# EasyEDA Pro project ProPrj_DiscoTech 6 Current_2026-05-06.epro, schematic Master

## Sheets
1 Volume/EQ: Board Name: Master; Create Date: 2025-11-04; Page Name: Volume/EQ; Project Name: DiscoTech 6 Current; Schematic Name: Master; Update Date: 2026-04-23; Company: EasyEDA.com; Page Size: A4; Version: V1.0
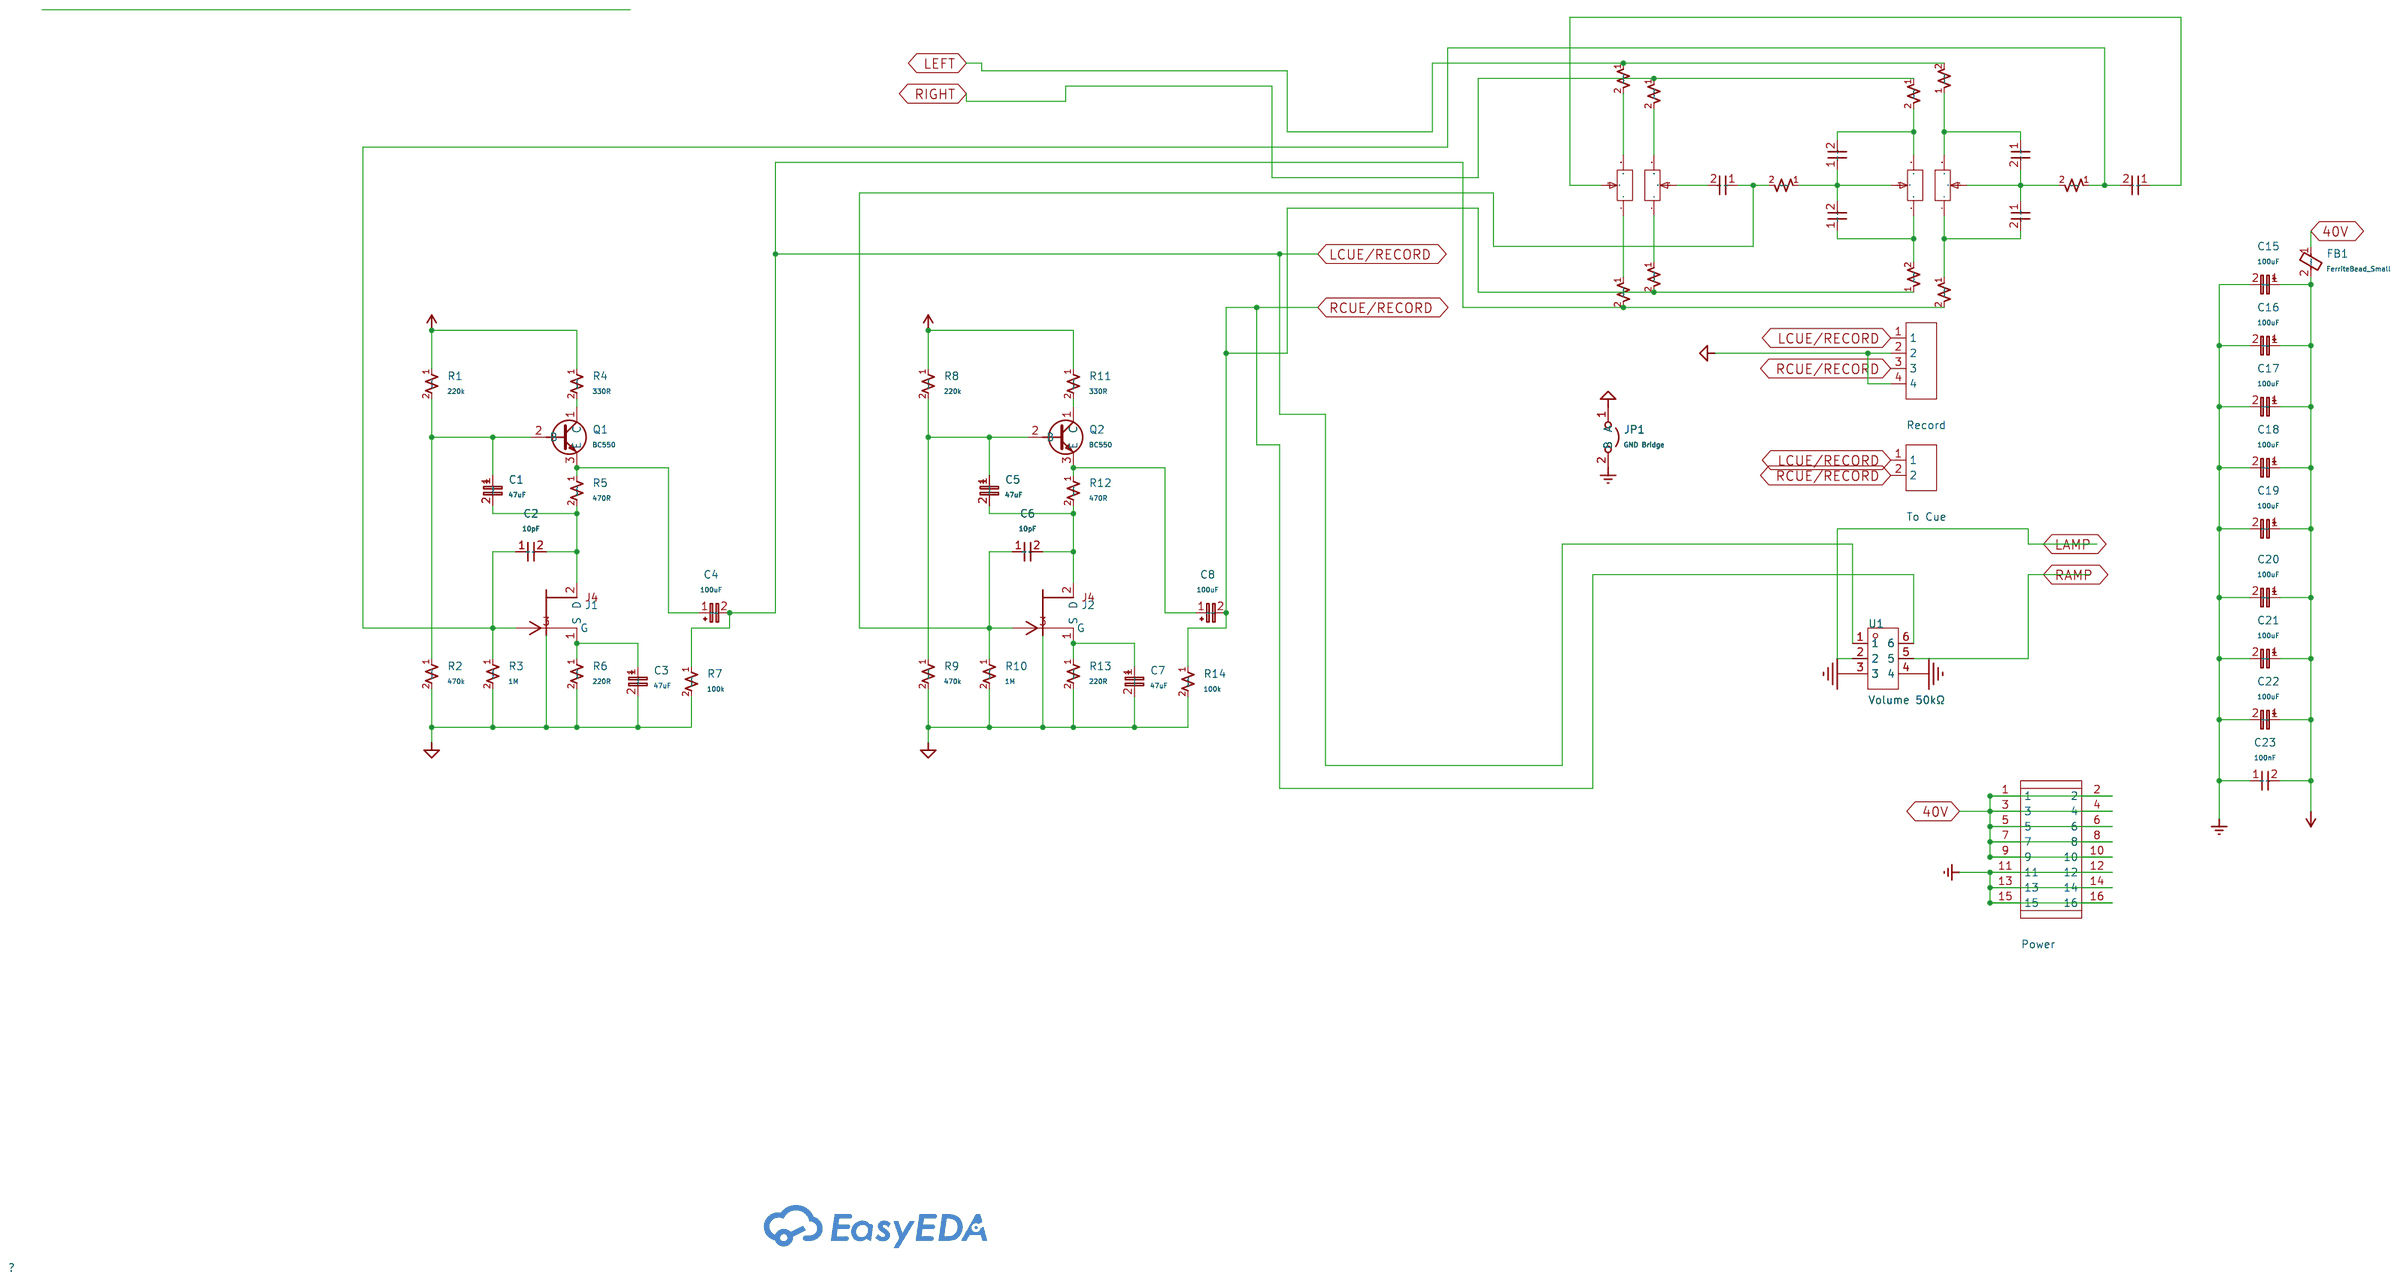
[diagram p9: Volume/EQ]
2 Summing: Page Name: Summing; Update Date: 2025-11-04
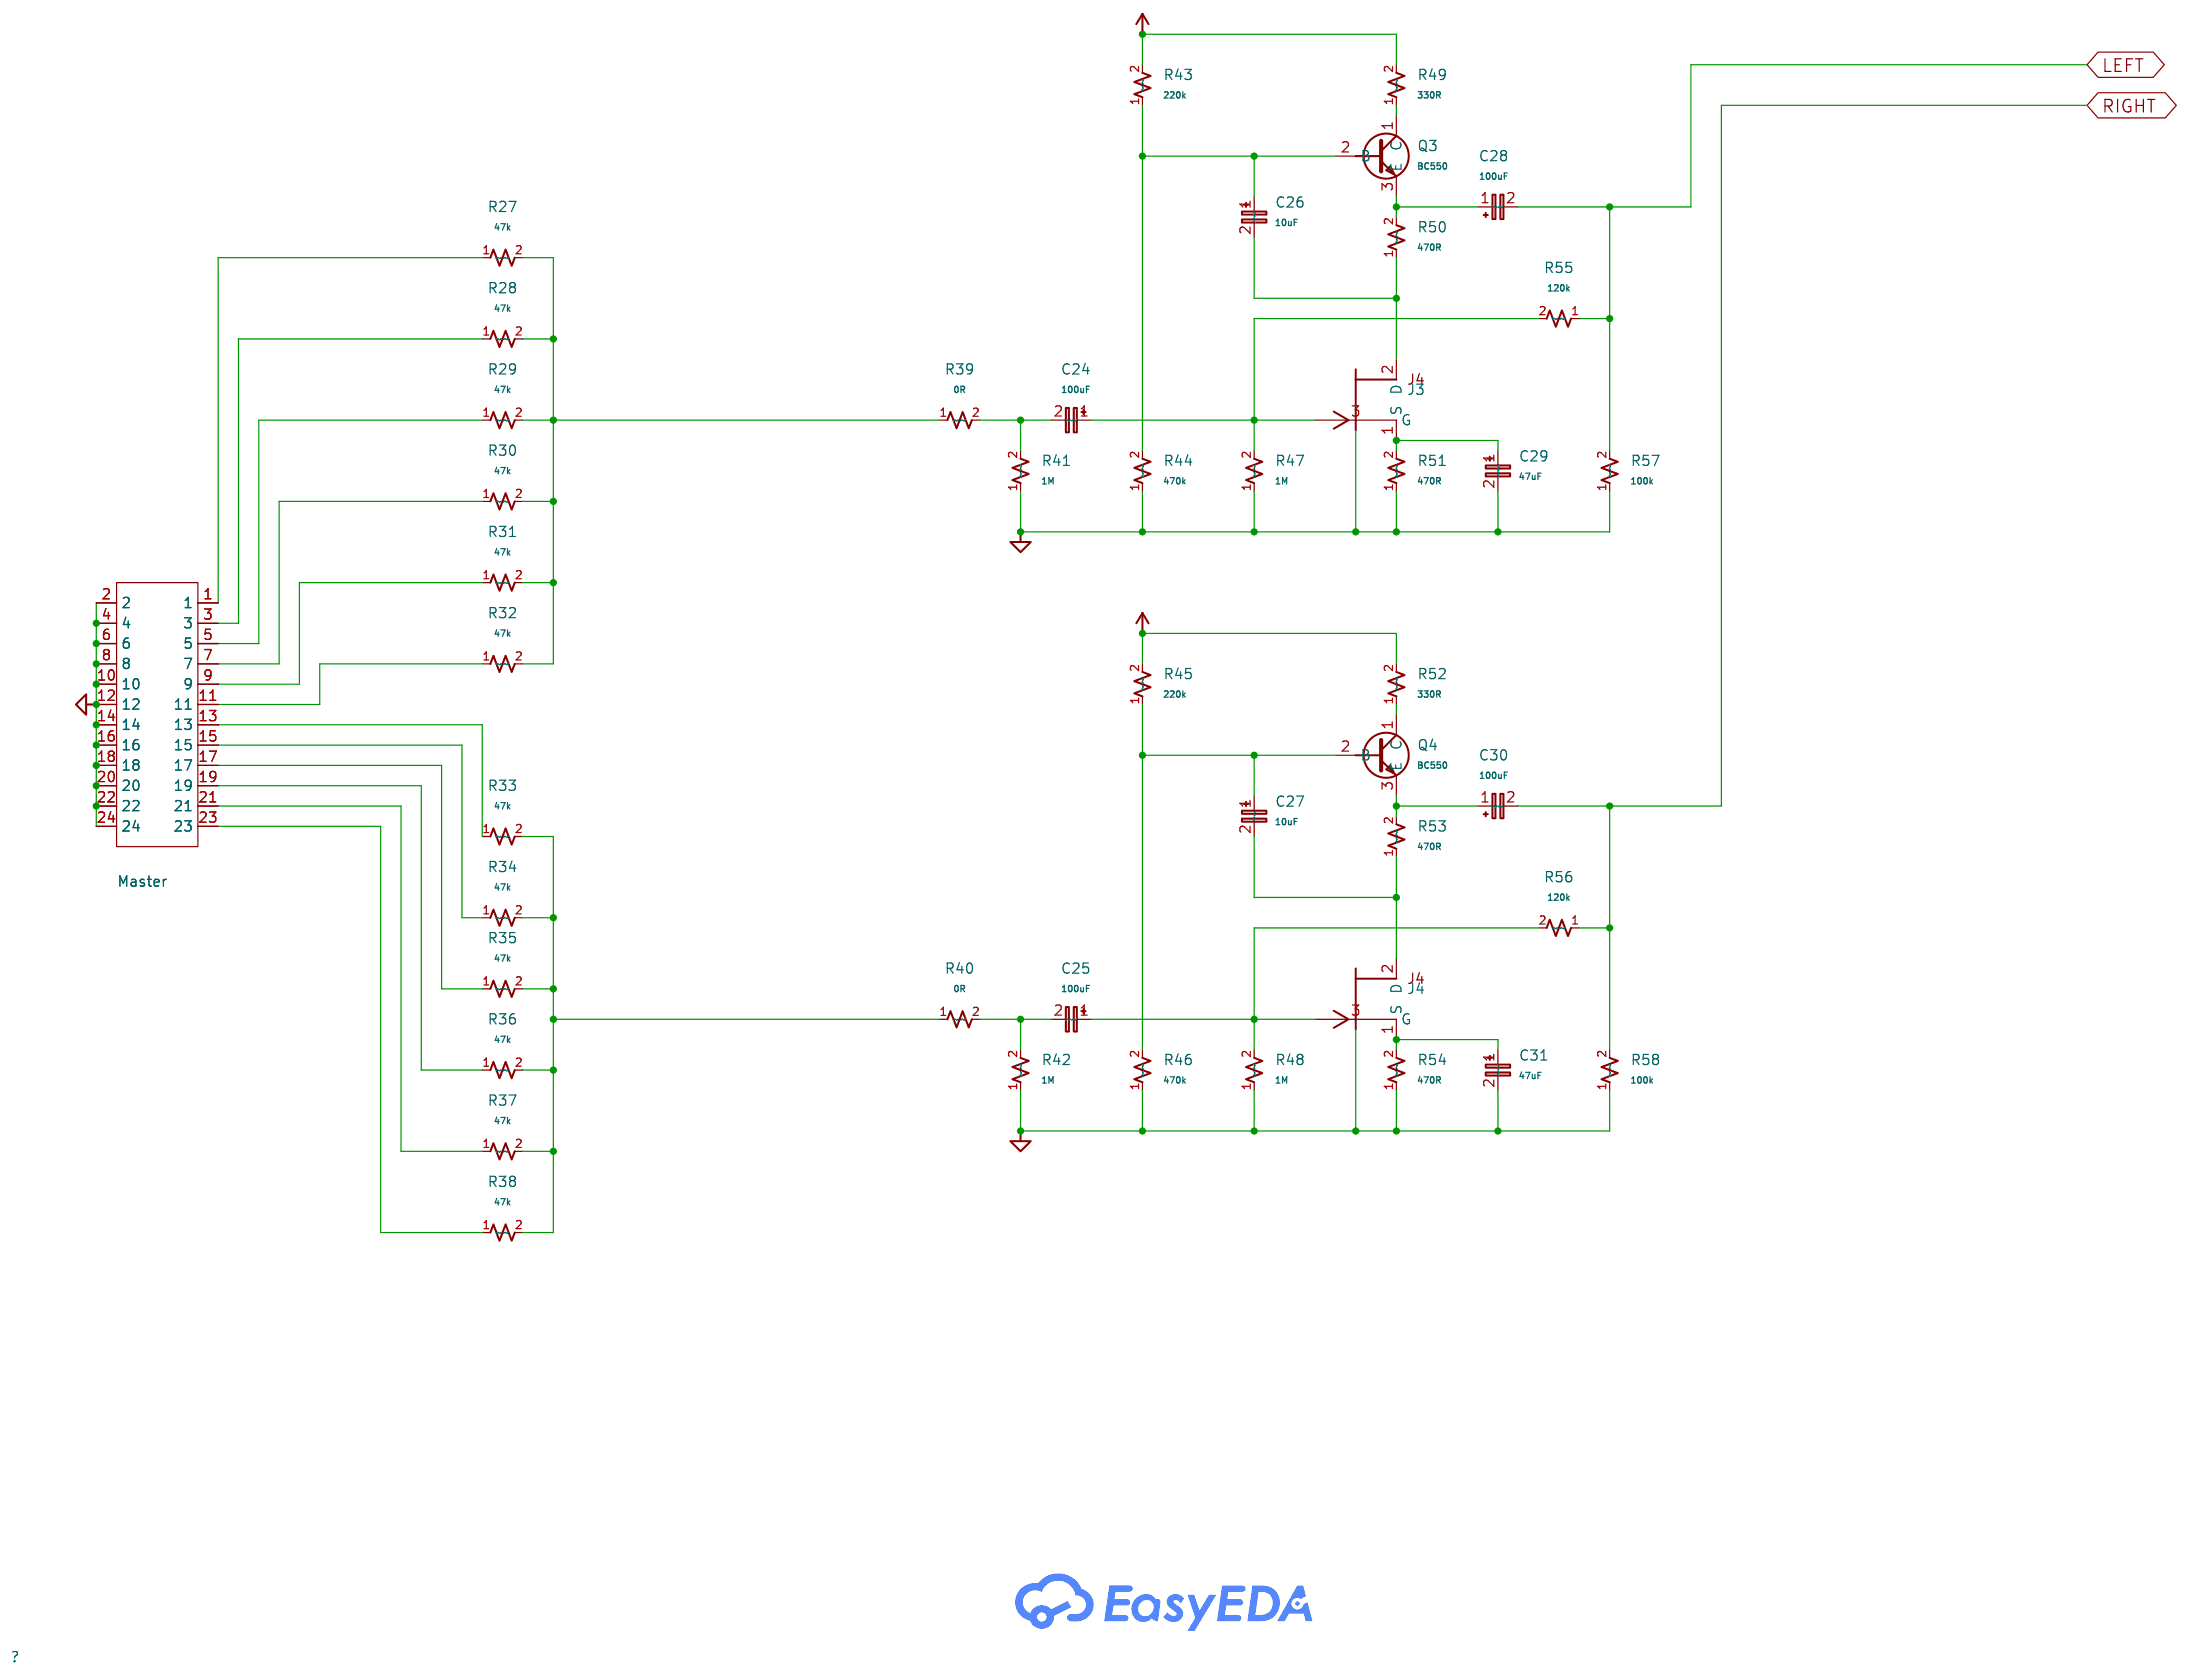
[diagram p10: Summing]
3 Amp: Create Date: 2025-11-05; Page Name: Amp; Update Date: 2026-04-27
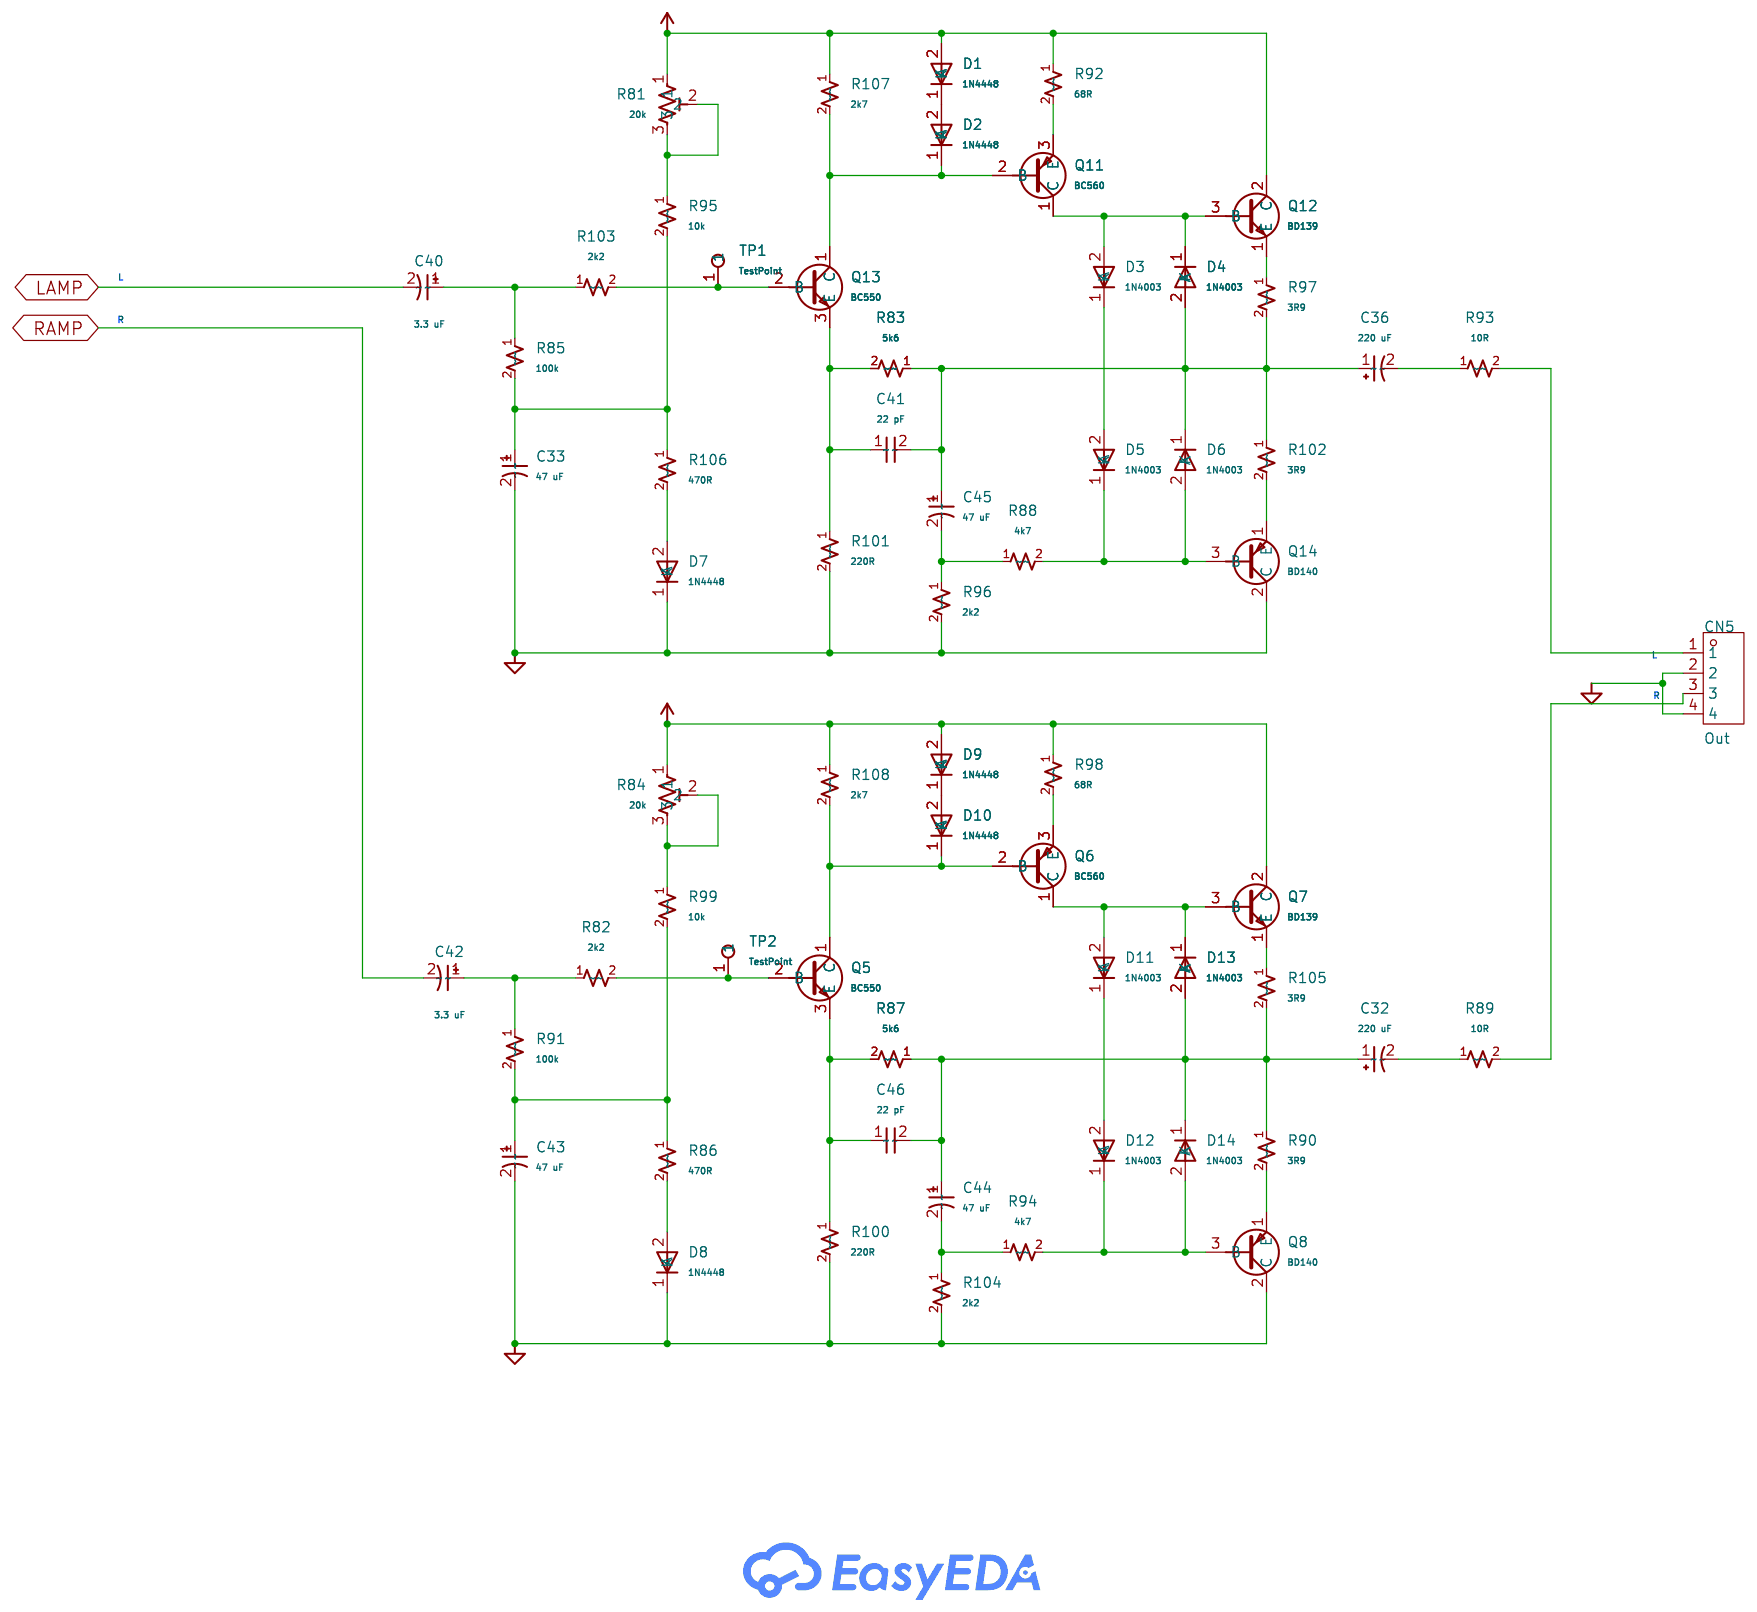
[diagram p11: Amp]

## Parts
sheet Amp
C32  220 uF  [Capacitor_THT:CP_Radial_D10.0mm_P5.00mm]
C33  47 uF  [Capacitor_THT:CP_Radial_D6.3mm_P2.50mm]
C36  220 uF  [Capacitor_THT:CP_Radial_D10.0mm_P5.00mm]
C40  3.3 uF  [Capacitor_THT:CP_Radial_Tantal_D5.0mm_P5.00mm]
C41  22 pF  [Capacitor_THT:C_Disc_D3.8mm_W2.6mm_P2.50mm]
C42  3.3 uF  [Capacitor_THT:CP_Radial_Tantal_D5.0mm_P5.00mm]
C43  47 uF  [Capacitor_THT:CP_Radial_D6.3mm_P2.50mm]
C44  47 uF  [Capacitor_THT:CP_Radial_D6.3mm_P2.50mm]
C45  47 uF  [Capacitor_THT:CP_Radial_D6.3mm_P2.50mm]
C46  22 pF  [Capacitor_THT:C_Disc_D3.8mm_W2.6mm_P2.50mm]
CN5  Out  [CONN-TH_4P-P2.50-XH2.54-4P]
D1  1N4448  [Diode_THT:D_DO-35_SOD27_P7.62mm_Horizontal]
D2  1N4448  [Diode_THT:D_DO-35_SOD27_P7.62mm_Horizontal]
D3  1N4003  [Diode_THT:D_DO-41_SOD81_P10.16mm_Horizontal]
D4  1N4003  [Diode_THT:D_DO-41_SOD81_P10.16mm_Horizontal]
D5  1N4003  [Diode_THT:D_DO-41_SOD81_P10.16mm_Horizontal]
D6  1N4003  [Diode_THT:D_DO-41_SOD81_P10.16mm_Horizontal]
D7  1N4448  [Diode_THT:D_DO-35_SOD27_P7.62mm_Horizontal]
D8  1N4448  [Diode_THT:D_DO-35_SOD27_P7.62mm_Horizontal]
D9  1N4448  [Diode_THT:D_DO-35_SOD27_P7.62mm_Horizontal]
D10  1N4448  [Diode_THT:D_DO-35_SOD27_P7.62mm_Horizontal]
D11  1N4003  [Diode_THT:D_DO-41_SOD81_P10.16mm_Horizontal]
D12  1N4003  [Diode_THT:D_DO-41_SOD81_P10.16mm_Horizontal]
D13  1N4003  [Diode_THT:D_DO-41_SOD81_P10.16mm_Horizontal]
D14  1N4003  [Diode_THT:D_DO-41_SOD81_P10.16mm_Horizontal]
Q5  BC550  [TO-92-3_L4.8-W3.7-P2.60-L_LP0003A]
Q6  BC560  [TO-92-3_L4.8-W3.7-P2.60-L_LP0003A]
Q7  BD139  [Package_TO_SOT_THT:TO-126-3_Vertical]
Q8  BD140  [Package_TO_SOT_THT:TO-126-3_Vertical]
Q11  BC560  [TO-92-3_L4.8-W3.7-P2.60-L_LP0003A]
Q12  BD139  [Package_TO_SOT_THT:TO-126-3_Vertical]
Q13  BC550  [TO-92-3_L4.8-W3.7-P2.60-L_LP0003A]
Q14  BD140  [Package_TO_SOT_THT:TO-126-3_Vertical]
R81  20k  [Potentiometer_THT:Potentiometer_Bourns_3296W_Vertical]
R82  2k2  [Resistor_THT:R_Axial_DIN0207_L6.3mm_D2.5mm_P7.62mm_Horizontal]
R83  5k6  [Resistor_THT:R_Axial_DIN0207_L6.3mm_D2.5mm_P7.62mm_Horizontal]
R84  20k  [Potentiometer_THT:Potentiometer_Bourns_3296W_Vertical]
R85  100k  [Resistor_THT:R_Axial_DIN0207_L6.3mm_D2.5mm_P7.62mm_Horizontal]
R86  470R  [Resistor_THT:R_Axial_DIN0207_L6.3mm_D2.5mm_P7.62mm_Horizontal]
R87  5k6  [Resistor_THT:R_Axial_DIN0207_L6.3mm_D2.5mm_P7.62mm_Horizontal]
R88  4k7  [Resistor_THT:R_Axial_DIN0207_L6.3mm_D2.5mm_P7.62mm_Horizontal]
R89  10R  [Resistor_THT:R_Axial_DIN0414_L11.9mm_D4.5mm_P15.24mm_Horizontal]
R90  3R9  [Resistor_THT:R_Axial_DIN0309_L9.0mm_D3.2mm_P12.70mm_Horizontal]
R91  100k  [Resistor_THT:R_Axial_DIN0207_L6.3mm_D2.5mm_P7.62mm_Horizontal]
R92  68R  [Resistor_THT:R_Axial_DIN0207_L6.3mm_D2.5mm_P7.62mm_Horizontal]
R93  10R  [Resistor_THT:R_Axial_DIN0414_L11.9mm_D4.5mm_P15.24mm_Horizontal]
R94  4k7  [Resistor_THT:R_Axial_DIN0207_L6.3mm_D2.5mm_P7.62mm_Horizontal]
R95  10k  [Resistor_THT:R_Axial_DIN0207_L6.3mm_D2.5mm_P7.62mm_Horizontal]
R96  2k2  [Resistor_THT:R_Axial_DIN0207_L6.3mm_D2.5mm_P7.62mm_Horizontal]
R97  3R9  [Resistor_THT:R_Axial_DIN0309_L9.0mm_D3.2mm_P12.70mm_Horizontal]
R98  68R  [Resistor_THT:R_Axial_DIN0207_L6.3mm_D2.5mm_P7.62mm_Horizontal]
R99  10k  [Resistor_THT:R_Axial_DIN0207_L6.3mm_D2.5mm_P7.62mm_Horizontal]
R100  220R  [Resistor_THT:R_Axial_DIN0207_L6.3mm_D2.5mm_P7.62mm_Horizontal]
R101  220R  [Resistor_THT:R_Axial_DIN0207_L6.3mm_D2.5mm_P7.62mm_Horizontal]
R102  3R9  [Resistor_THT:R_Axial_DIN0309_L9.0mm_D3.2mm_P12.70mm_Horizontal]
R103  2k2  [Resistor_THT:R_Axial_DIN0207_L6.3mm_D2.5mm_P7.62mm_Horizontal]
R104  2k2  [Resistor_THT:R_Axial_DIN0207_L6.3mm_D2.5mm_P7.62mm_Horizontal]
R105  3R9  [Resistor_THT:R_Axial_DIN0309_L9.0mm_D3.2mm_P12.70mm_Horizontal]
R106  470R  [Resistor_THT:R_Axial_DIN0207_L6.3mm_D2.5mm_P7.62mm_Horizontal]
R107  2k7  [Resistor_THT:R_Axial_DIN0207_L6.3mm_D2.5mm_P7.62mm_Horizontal]
R108  2k7  [Resistor_THT:R_Axial_DIN0207_L6.3mm_D2.5mm_P7.62mm_Horizontal]
TP1  TestPoint  [Connector_PinHeader_2.54mm:PinHeader_1x01_P2.54mm_Vertical]
TP2  TestPoint  [Connector_PinHeader_2.54mm:PinHeader_1x01_P2.54mm_Vertical]
sheet Summing
C24  100uF  [Capacitor_THT:CP_Radial_D10.0mm_P5.00mm]
C25  100uF  [Capacitor_THT:CP_Radial_D10.0mm_P5.00mm]
C26  10uF  [Capacitor_THT:CP_Radial_D6.3mm_P2.50mm]
C27  10uF  [Capacitor_THT:CP_Radial_D6.3mm_P2.50mm]
C28  100uF  [Capacitor_THT:CP_Radial_D10.0mm_P5.00mm]
C29  47uF  [Capacitor_THT:CP_Radial_D6.3mm_P2.50mm]
C30  100uF  [Capacitor_THT:CP_Radial_D10.0mm_P5.00mm]
C31  47uF  [Capacitor_THT:CP_Radial_D6.3mm_P2.50mm]
J3  -  [2n3822]
J4  -  [2n3822]
P2  Master  [IDC-TH_24P-P2.54_ZHOURI_DC3-2.54-24PAL]
Q3  BC550  [TO-92-3_L4.8-W3.7-P2.60-L_LP0003A]
Q4  BC550  [TO-92-3_L4.8-W3.7-P2.60-L_LP0003A]
R27  47k  [Resistor_THT:R_Axial_DIN0207_L6.3mm_D2.5mm_P7.62mm_Horizontal]
R28  47k  [Resistor_THT:R_Axial_DIN0207_L6.3mm_D2.5mm_P7.62mm_Horizontal]
R29  47k  [Resistor_THT:R_Axial_DIN0207_L6.3mm_D2.5mm_P7.62mm_Horizontal]
R30  47k  [Resistor_THT:R_Axial_DIN0207_L6.3mm_D2.5mm_P7.62mm_Horizontal]
R31  47k  [Resistor_THT:R_Axial_DIN0207_L6.3mm_D2.5mm_P7.62mm_Horizontal]
R32  47k  [Resistor_THT:R_Axial_DIN0207_L6.3mm_D2.5mm_P7.62mm_Horizontal]
R33  47k  [Resistor_THT:R_Axial_DIN0207_L6.3mm_D2.5mm_P7.62mm_Horizontal]
R34  47k  [Resistor_THT:R_Axial_DIN0207_L6.3mm_D2.5mm_P7.62mm_Horizontal]
R35  47k  [Resistor_THT:R_Axial_DIN0207_L6.3mm_D2.5mm_P7.62mm_Horizontal]
R36  47k  [Resistor_THT:R_Axial_DIN0207_L6.3mm_D2.5mm_P7.62mm_Horizontal]
R37  47k  [Resistor_THT:R_Axial_DIN0207_L6.3mm_D2.5mm_P7.62mm_Horizontal]
R38  47k  [Resistor_THT:R_Axial_DIN0207_L6.3mm_D2.5mm_P7.62mm_Horizontal]
R39  0R  [Resistor_THT:R_Axial_DIN0207_L6.3mm_D2.5mm_P7.62mm_Horizontal]
R40  0R  [Resistor_THT:R_Axial_DIN0207_L6.3mm_D2.5mm_P7.62mm_Horizontal]
R41  1M  [Resistor_THT:R_Axial_DIN0207_L6.3mm_D2.5mm_P7.62mm_Horizontal]
R42  1M  [Resistor_THT:R_Axial_DIN0207_L6.3mm_D2.5mm_P7.62mm_Horizontal]
R43  220k  [Resistor_THT:R_Axial_DIN0207_L6.3mm_D2.5mm_P7.62mm_Horizontal]
R44  470k  [Resistor_THT:R_Axial_DIN0207_L6.3mm_D2.5mm_P7.62mm_Horizontal]
R45  220k  [Resistor_THT:R_Axial_DIN0207_L6.3mm_D2.5mm_P7.62mm_Horizontal]
R46  470k  [Resistor_THT:R_Axial_DIN0207_L6.3mm_D2.5mm_P7.62mm_Horizontal]
R47  1M  [Resistor_THT:R_Axial_DIN0207_L6.3mm_D2.5mm_P7.62mm_Horizontal]
R48  1M  [Resistor_THT:R_Axial_DIN0207_L6.3mm_D2.5mm_P7.62mm_Horizontal]
R49  330R  [Resistor_THT:R_Axial_DIN0207_L6.3mm_D2.5mm_P7.62mm_Horizontal]
R50  470R  [Resistor_THT:R_Axial_DIN0207_L6.3mm_D2.5mm_P7.62mm_Horizontal]
R51  470R  [Resistor_THT:R_Axial_DIN0207_L6.3mm_D2.5mm_P7.62mm_Horizontal]
R52  330R  [Resistor_THT:R_Axial_DIN0207_L6.3mm_D2.5mm_P7.62mm_Horizontal]
R53  470R  [Resistor_THT:R_Axial_DIN0207_L6.3mm_D2.5mm_P7.62mm_Horizontal]
R54  470R  [Resistor_THT:R_Axial_DIN0207_L6.3mm_D2.5mm_P7.62mm_Horizontal]
R55  120k  [Resistor_THT:R_Axial_DIN0207_L6.3mm_D2.5mm_P7.62mm_Horizontal]
R56  120k  [Resistor_THT:R_Axial_DIN0207_L6.3mm_D2.5mm_P7.62mm_Horizontal]
R57  100k  [Resistor_THT:R_Axial_DIN0207_L6.3mm_D2.5mm_P7.62mm_Horizontal]
R58  100k  [Resistor_THT:R_Axial_DIN0207_L6.3mm_D2.5mm_P7.62mm_Horizontal]
sheet Volume/EQ
C1  47uF  [Capacitor_THT:CP_Radial_D6.3mm_P2.50mm]
C2  10pF  [Capacitor_THT:C_Disc_D3.8mm_W2.6mm_P2.50mm]
C3  47uF  [Capacitor_THT:CP_Radial_D6.3mm_P2.50mm]
C4  100uF  [Capacitor_THT:CP_Radial_D10.0mm_P5.00mm]
C5  47uF  [Capacitor_THT:CP_Radial_D6.3mm_P2.50mm]
C6  10pF  [Capacitor_THT:C_Disc_D3.8mm_W2.6mm_P2.50mm]
C7  47uF  [Capacitor_THT:CP_Radial_D6.3mm_P2.50mm]
C8  100uF  [Capacitor_THT:CP_Radial_D10.0mm_P5.00mm]
C9  2.2nF  [Capacitor_THT:C_Rect_L10.0mm_W4.0mm_P7.50mm_FKS3_FKP3]
C10  68nF  [Capacitor_THT:C_Rect_L13.0mm_W6.0mm_P10.00mm_FKS3_FKP3_MKS4]
C11  68nF  [Capacitor_THT:C_Rect_L13.0mm_W6.0mm_P10.00mm_FKS3_FKP3_MKS4]
C12  68nF  [Capacitor_THT:C_Rect_L13.0mm_W6.0mm_P10.00mm_FKS3_FKP3_MKS4]
C13  68nF  [Capacitor_THT:C_Rect_L13.0mm_W6.0mm_P10.00mm_FKS3_FKP3_MKS4]
C14  2.2nF  [Capacitor_THT:C_Rect_L10.0mm_W4.0mm_P7.50mm_FKS3_FKP3]
C15  100uF  [Capacitor_THT:CP_Radial_D10.0mm_P5.00mm]
C16  100uF  [Capacitor_THT:CP_Radial_D10.0mm_P5.00mm]
C17  100uF  [Capacitor_THT:CP_Radial_D10.0mm_P5.00mm]
C18  100uF  [Capacitor_THT:CP_Radial_D10.0mm_P5.00mm]
C19  100uF  [Capacitor_THT:CP_Radial_D10.0mm_P5.00mm]
C20  100uF  [Capacitor_THT:CP_Radial_D10.0mm_P5.00mm]
C21  100uF  [Capacitor_THT:CP_Radial_D10.0mm_P5.00mm]
C22  100uF  [Capacitor_THT:CP_Radial_D10.0mm_P5.00mm]
C23  100nF  [Capacitor_THT:C_Rect_L7.2mm_W2.5mm_P5.00mm_FKS2_FKP2_MKS2_MKP2]
CN1  Record  [CONN-TH_4P-P2.50-XH2.54-4P]
CN2  To Cue  [CONN-TH_2P-P2.50_HX-2.54MM-2P-ZZ-MS]
FB1  FerriteBead_Small  [Inductor_THT:L_Axial_L9.5mm_D4.0mm_P12.70mm_Horizontal_Fastron_SMCC]
J1  -  [2n3822]
J2  -  [2n3822]
JP1  GND Bridge  [Connector_PinHeader_2.54mm:PinHeader_1x02_P2.54mm_Vertical]
P1  Power  [CONN-TH_16P-P2.54_C9142]
Q1  BC550  [TO-92-3_L4.8-W3.7-P2.60-L_LP0003A]
Q2  BC550  [TO-92-3_L4.8-W3.7-P2.60-L_LP0003A]
R1  220k  [Resistor_THT:R_Axial_DIN0207_L6.3mm_D2.5mm_P7.62mm_Horizontal]
R2  470k  [Resistor_THT:R_Axial_DIN0207_L6.3mm_D2.5mm_P7.62mm_Horizontal]
R3  1M  [Resistor_THT:R_Axial_DIN0207_L6.3mm_D2.5mm_P7.62mm_Horizontal]
R4  330R  [Resistor_THT:R_Axial_DIN0207_L6.3mm_D2.5mm_P7.62mm_Horizontal]
R5  470R  [Resistor_THT:R_Axial_DIN0207_L6.3mm_D2.5mm_P7.62mm_Horizontal]
R6  220R  [Resistor_THT:R_Axial_DIN0207_L6.3mm_D2.5mm_P7.62mm_Horizontal]
R7  100k  [Resistor_THT:R_Axial_DIN0207_L6.3mm_D2.5mm_P7.62mm_Horizontal]
R8  220k  [Resistor_THT:R_Axial_DIN0207_L6.3mm_D2.5mm_P7.62mm_Horizontal]
R9  470k  [Resistor_THT:R_Axial_DIN0207_L6.3mm_D2.5mm_P7.62mm_Horizontal]
R10  1M  [Resistor_THT:R_Axial_DIN0207_L6.3mm_D2.5mm_P7.62mm_Horizontal]
R11  330R  [Resistor_THT:R_Axial_DIN0207_L6.3mm_D2.5mm_P7.62mm_Horizontal]
R12  470R  [Resistor_THT:R_Axial_DIN0207_L6.3mm_D2.5mm_P7.62mm_Horizontal]
R13  220R  [Resistor_THT:R_Axial_DIN0207_L6.3mm_D2.5mm_P7.62mm_Horizontal]
R14  100k  [Resistor_THT:R_Axial_DIN0207_L6.3mm_D2.5mm_P7.62mm_Horizontal]
R15  3k3  [Resistor_THT:R_Axial_DIN0207_L6.3mm_D2.5mm_P7.62mm_Horizontal]
R16  Treble 50kΩ  [RES-ADJ-TH_RK16312A0BKH]
R17  3k3  [Resistor_THT:R_Axial_DIN0207_L6.3mm_D2.5mm_P7.62mm_Horizontal]
R18  3k3  [Resistor_THT:R_Axial_DIN0207_L6.3mm_D2.5mm_P7.62mm_Horizontal]
R19  3k3  [Resistor_THT:R_Axial_DIN0207_L6.3mm_D2.5mm_P7.62mm_Horizontal]
R20  6k8  [Resistor_THT:R_Axial_DIN0207_L6.3mm_D2.5mm_P7.62mm_Horizontal]
R21  12k  [Resistor_THT:R_Axial_DIN0207_L6.3mm_D2.5mm_P7.62mm_Horizontal]
R22  Bass 50kΩ  [RES-ADJ-TH_RK16312A0BKH]
R23  12k  [Resistor_THT:R_Axial_DIN0207_L6.3mm_D2.5mm_P7.62mm_Horizontal]
R24  12k  [Resistor_THT:R_Axial_DIN0207_L6.3mm_D2.5mm_P7.62mm_Horizontal]
R25  12k  [Resistor_THT:R_Axial_DIN0207_L6.3mm_D2.5mm_P7.62mm_Horizontal]
R26  6k8  [Resistor_THT:R_Axial_DIN0207_L6.3mm_D2.5mm_P7.62mm_Horizontal]
U1  Volume 50kΩ  [RES-ADJ-TH_RK27112A0A16]

## Library data of the parts
C32 C33 C36 C40 C42-C45 = Device_C_Polarized_Small_US: Polarized capacitor, small US symbol; Users: REF**
C2 C6 C9-C14 C23 C41 C46 = Device_C_Small: Unpolarized capacitor, small symbol; Users: REF**
CN1 CN5 = HX-XH2.54-4PZZ: Pins Structure:1x4P Pitch:2.54mm Mounting Type:Through Hole Reference Series:XH Number of Pins:4P Number of Rows:1 Number of PINs Per Row:4 Row Spacing:- Current Rating:3A Contact Material:Brass Contact Plating:Tin Operating Temperature:-25℃~+85℃ Operatin; LCSC Part Name: 1x4P 间距:2.54mm 直插 系列:XH; Supplier Part: C42391662; Manufacturer: hanxia(韩下); Supplier Footprint: 插件,P=2.5mm; JLCPCB Part Class: Extended Part; Datasheet: https://item.szlcsc.com/datasheet/HX-XH2.54-4PZZ/44326934.html; Supplier: LCSC; Pins Structure: 1x4P; Pitch: 2.54mm; Mounting Type: Through Hole; Reference Series: XH; Number of Pins: 4P; Number of Rows: 1; Number of PINs Per Row: 4; Current Rating: 3A; Contact Material: Brass; Contact Plating: Tin; Operating Temperature: -25℃~+85℃; Voltage Rating: 250V; Plastic Material: PA66; Flame Retardant Rating: UL94V-0; Color: White
D1 D2 D7-D10 = Diode_1N4448: 100V 0.15A High-speed standard diode, DO-35; Users: K; datasheet: https://assets.nexperia.com/documents/data-sheet/1N4148_1N4448.pdf; sim_device: D; sim_pins: 1=K 2=A; User doc link: https://assets.nexperia.com/documents/data-sheet/1N4148_1N4448.pdf; Sim.Device: D; Sim.Pins: 1=K 2=A
D3-D6 D11-D14 = Diode_1N4003: 200V 1A General Purpose Rectifier Diode, DO-41; Users: REF**; datasheet: http://www.vishay.com/docs/88503/1n4001.pdf; sim_device: D; sim_pins: 1=K 2=A; User doc link: http://www.vishay.com/docs/88503/1n4001.pdf; Sim.Device: D; Sim.Pins: 1=K 2=A
Q1 Q2 Q5 Q13 = Transistor_BJT_BC550: 0.1A Ic, 45V Vce, Small Signal NPN Transistor, TO-92; User doc link: https://www.onsemi.com/pub/Collateral/BC550-D.pdf
Q6 Q11 = Transistor_BJT_BC560: 0.1A Ic, 45V Vce, PNP Small Signal Transistor, TO-92; Users: REF**; datasheet: https://www.onsemi.com/pub/Collateral/BC550-D.pdf; User doc link: https://www.onsemi.com/pub/Collateral/BC556BTA-D.pdf
Q7 Q12 = Transistor_BJT_BD139: 1.5A Ic, 80V Vce, Low Voltage Transistor, TO-126; User doc link: http://www.st.com/internet/com/TECHNICAL_RESOURCES/TECHNICAL_LITERATURE/DATASHEET/CD00001225.pdf
Q8 Q14 = Transistor_BJT_BD140: 1.5A Ic, 80V Vce, Low Voltage Transistor, TO-126; Users: REF**; datasheet: http://www.st.com/internet/com/TECHNICAL_RESOURCES/TECHNICAL_LITERATURE/DATASHEET/CD00001225.pdf; User doc link: http://www.st.com/internet/com/TECHNICAL_RESOURCES/TECHNICAL_LITERATURE/DATASHEET/CD00001225.pdf
R81 R84 = Device_R_Potentiometer_Trim_US: Trim-potentiometer, US symbol; Users: REF**
R1-R15 R17-R21 R23-R58 R82 R83 R85-R108 = Device_R_Small_US: Resistor, small US symbol; Users: REF**
TP1 TP2 = Connector_TestPoint: test point; Users: REF**
C1 C3-C5 C7 C8 C15-C22 C24-C31 = Device_C_Polarized_Small: Polarized capacitor, small symbol; Users: REF**
J1-J4 = 2n3822
P2 = DS1013-24RSiB-B-0: Connector Type:IDC Header Pitch:2.54mm Number of Positions or Pins:2x12P Holder Type:Right Angle Number of Rows:2 Number of PINs Per Row:12; LCSC Part Name: 2.54mm 2x12P 排数:2 每排P数:12; Supplier Part: C7430325; Manufacturer: CONNFLY; Supplier Footprint: 弯插,P=2.54mm; JLCPCB Part Class: Extended Part; Datasheet: https://item.szlcsc.com/datasheet/DS1013-24RSiB-B-0/8429959.html; Supplier: LCSC; Connector Type: IDC Header; Pitch: 2.54mm; Number of Positions or Pins: 2x12P; Holder Type: Right Angle; Number of Rows: 2; Number of PINs Per Row: 12; Row Spacing: 2.54mm
Q3 Q4 = Transistor_BJT_BC550: 0.1A Ic, 45V Vce, Small Signal NPN Transistor, TO-92; Users: REF**; datasheet: https://www.onsemi.com/pub/Collateral/BC550-D.pdf; User doc link: https://www.onsemi.com/pub/Collateral/BC550-D.pdf
CN2 = HX-XH2.54-2PZZ: Pins Structure:1x2P Pitch:2.54mm Mounting Type:Straight Reference Series:XH Number of Pins:2P Number of Rows:1 Number of PINs Per Row:2 Row Spacing:- Current Rating:3A Contact Material:Brass Contact Plating:Tin Operating Temperature:-25℃~+85℃ Operating Te; LCSC Part Name: 1x2P 间距:2.5mm 直插 系列:XH; Supplier Part: C42391660; Manufacturer: hanxia(韩下); Supplier Footprint: 插件,P=2.5mm; JLCPCB Part Class: Extended Part; Datasheet: https://item.szlcsc.com/datasheet/HX-XH2.54-2PZZ/44326932.html; Supplier: LCSC; Pins Structure: 1x2P; Pitch: 2.54mm; Mounting Type: Straight; Reference Series: XH; Number of Pins: 2P; Number of Rows: 1; Number of PINs Per Row: 2; Current Rating: 3A; Contact Material: Brass; Contact Plating: Tin; Operating Temperature: -25℃~+85℃; Voltage Rating: 250V; Plastic Material: PA66; Flame Retardant Rating: UL94V-0; Color: White
FB1 = Device_FerriteBead_Small: Ferrite bead, small symbol; Users: REF**
JP1 = Jumper_Jumper_2_Open: Jumper, 2-pole, open; Users: REF**
P1 = 2.54-2*8P弯简牛: Connector Type:IDC Header Pitch:2.54mm Number of Positions or Pins:2x8P Holder Type:Right Angle Row Spacing:2.54mm Number of Rows:2 Number of PINs Per Row:8 Contact Material:- Contact Plating:-; LCSC Part Name: 2.54mm 2x8P 排数:2 每排P数:8; Supplier Part: C9142; Manufacturer: BOOMELE(博穆精密); Supplier Footprint: 弯插,P=2.54mm; JLCPCB Part Class: Extended Part; Datasheet: https://item.szlcsc.com/datasheet/2.54-2*8P%25E5%25BC%25AF%25E7%25AE%2580%25E7%2589%259B/9665.html; Supplier: LCSC; Connector Type: IDC Header; Pitch: 2.54mm; Number of Positions or Pins: 2x8P; Holder Type: Right Angle; Row Spacing: 2.54mm; Number of Rows: 2; Number of PINs Per Row: 8
R16 R22 = RK16312A0BKH: Resistance: Tolerance:±20% Tolerance:±20%; LCSC Part Name: 50kΩ ±20% 停产; Supplier Part: C231749; Manufacturer: ALPSALPINE(阿尔卑斯阿尔派); Supplier Footprint: 插件; JLCPCB Part Class: Extended Part; Datasheet: https://atta.szlcsc.com/upload/public/pdf/source/20180613/C231749_F0A00B2AA60C42757A3F15B1E5114770.pdf; Supplier: LCSC; Tolerance: ±20%
U1 = RK27112A0A16: Resistance: Tolerance:±20% Tolerance:±20% Rated Voltage:- Power(Watts):- Turns:-; LCSC Part Name: 100kΩ ±20% 3件套; Supplier Part: C470508; Manufacturer: ALPSALPINE(阿尔卑斯阿尔派); Supplier Footprint: DIP-6P,27x24.5mm; JLCPCB Part Class: Extended Part; Datasheet: https://atta.szlcsc.com/upload/public/pdf/source/20191216/C470509_1AC214E673023FF0853974852A92149F.pdf; Supplier: LCSC; Tolerance: ±20%

## Nets
40V: FB1.1 P1.1 P1.2 P1.3 P1.4 P1.5 P1.6 P1.7 P1.8 P1.9 P1.10
GNDREF: C15.2 C16.2 C17.2 C18.2 C19.2 C20.2 C21.2 C22.2 C23.1 JP1.2(B) P1.11 P1.12 P1.13 P1.14 P1.15 P1.16
GNDS: C3.2 C7.2 C29.2 C31.2 C33.2 C43.2 CN1.2 CN1.4 CN5.2 CN5.4 D7.1(K) D8.1(K) JP1.1(A) P2.2 P2.4 P2.6 P2.8 P2.10 P2.12 P2.14 P2.16 P2.18 P2.20 P2.22 P2.24 Q8.2(C) Q14.2(C) R2.2 R3.2 R6.2 R7.2 R9.2 R10.2 R13.2 R14.2 R41.1 R42.1 R44.1 R46.1 R47.1 R48.1 R51.1 R54.1 R57.1 R58.1 R96.2 R100.2 R101.2 R104.2 U1.3 U1.4
LAMP: C40.2 U1.2
LCUE/RECORD: C4.2 CN1.1 CN2.1 R7.1 R17.2 R25.2 U1.1
LEFT: C28.2 R15.1 R24.2 R55.1 R57.2
RAMP: C42.2 U1.5
RCUE/RECORD: C8.2 CN1.3 CN2.2 R14.1 R19.2 R23.1 U1.6
RIGHT: C30.2 R18.1 R21.1 R56.1 R58.2
VDC: C15.1 C16.1 C17.1 C18.1 C19.1 C20.1 C21.1 C22.1 C23.2 D1.2(A) D9.2(A) FB1.2 Q7.2(C) Q12.2(C) R1.1 R4.1 R8.1 R11.1 R43.2 R45.2 R49.2 R52.2 R81.1 R84.1 R92.1 R98.1 R107.1 R108.1
$1N449: C2.1 C14.2 J1.3(G) R3.1 R26.1
$1N454: C1.2 C2.2 J1.2(D) R5.2
$1N461: C4.1 Q1.3(E) R5.1
$1N470: C1.1 Q1.2(B) R1.2 R2.1
$1N476: C3.1 J1.1(S) R6.1
$1N480: Q1.1(C) R4.2
$1N855: C6.1 C9.1 J2.3(G) R10.1 R20.2
$1N860: C5.2 C6.2 J2.2(D) R12.2
$1N867: C8.1 Q2.3(E) R12.1
$1N876: C5.1 Q2.2(B) R8.2 R9.1
$1N882: C7.1 J2.1(S) R13.1
$1N886: Q2.1(C) R11.2
$1N6655: C12.1 R22.6 R24.1
$1N6656: C13.2 R22.4 R25.1
$1N6657: C12.2 C13.1 R22.5 R26.2
$1N6659: C10.2 R21.2 R22.3
$1N6660: C11.1 R22.1 R23.2
$1N6661: C10.1 C11.2 R20.1 R22.2
$1N6663: C9.2 R16.2
$1N6664: C14.1 R16.5
$1N6665: R16.3 R18.2
$1N6666: R16.1 R19.1
$1N6667: R16.4 R17.1
$1N6668: R15.2 R16.6
$3N1818: R27.2 R28.2 R29.2 R30.2 R31.2 R32.2 R39.1
$3N1831: C28.1 Q3.3(E) R50.2
$3N1835: Q4.1(C) R52.1
$3N1853: R33.2 R34.2 R35.2 R36.2 R37.2 R38.2 R40.1
$3N1889: C26.2 J3.2(D) R50.1
$3N1914: C27.2 J4.2(D) R53.1
$3N1919: C30.1 Q4.3(E) R53.2
$3N1923: Q3.1(C) R49.1
$3N1929: C26.1 Q3.2(B) R43.1 R44.2
$3N1935: C25.2 R40.2 R42.2
$3N1939: C31.1 J4.1(S) R54.2
$3N1943: C24.1 J3.3(G) R47.2 R55.2
$3N1949: C29.1 J3.1(S) R51.2
$3N1953: C25.1 J4.3(G) R48.2 R56.2
$3N1959: C27.1 Q4.2(B) R45.1 R46.2
$3N1965: C24.2 R39.2 R41.2
$3N2004: P2.1 R27.1
$3N2007: P2.3 R28.1
$3N2011: P2.5 R29.1
$3N2015: P2.7 R30.1
$3N2019: P2.9 R31.1
$3N2023: P2.11 R32.1
$3N2027: P2.13 R33.1
$3N2030: P2.15 R34.1
$3N2034: P2.17 R35.1
$3N2038: P2.19 R36.1
$3N2042: P2.21 R37.1
$3N2046: P2.23 R38.1
$4N2217: D2.1(K) Q11.2(B) Q13.1(C) R107.2
$4N2223: D3.2(A) D4.1(K) Q11.1(C) Q12.3(B)
$4N2229: R84.2 R84.3 R99.1
$4N2235: D5.1(K) D6.2(A) Q14.3(B) R88.2
$4N2251: C41.1 Q13.3(E) R83.2 R101.1
$4N2271: Q11.3(E) R92.2
$4N2289: C36.1 C41.2 C45.1 D4.2(A) D6.1(K) R83.1 R97.2 R102.1
$4N2321: C46.1 Q5.3(E) R87.2 R100.1
$4N2327: C43.1 R86.1 R91.2 R99.2
$4N2333: C32.1 C44.1 C46.2 D13.2(A) D14.1(K) R87.1 R90.1 R105.2
$4N2359: Q8.1(E) R90.2
$4N2361: Q13.2(B) R103.2 TP1.1
$4N2372: C45.2 R88.1 R96.1
$4N2379: C44.2 R94.1 R104.1
$4N2387: D8.2(A) R86.2
$4N2389: R81.2 R81.3 R95.1
$4N2404: C42.1 R82.1 R91.1
$4N2408: D11.2(A) D13.1(K) Q6.1(C) Q7.3(B)
$4N2414: D12.1(K) D14.2(A) Q8.3(B) R94.2
$4N2420: D11.1(K) D12.2(A)
$4N2422: Q5.2(B) R82.2 TP2.1
$4N2425: Q7.1(E) R105.1
$4N2427: C32.2 R89.1
$4N2431: D10.1(K) Q5.1(C) Q6.2(B) R108.2
$4N2437: C33.1 R85.2 R95.2 R106.1
$4N2443: Q12.1(E) R97.1
$4N2445: D3.1(K) D5.2(A)
$4N2454: C36.2 R93.1
$4N2456: Q14.1(E) R102.2
$4N2460: D7.2(A) R106.2
$4N2462: Q6.3(E) R98.2
$4N2464: D9.1(K) D10.2(A)
$4N2466: D1.1(K) D2.2(A)
$4N8112: C40.1 R85.1 R103.1
$4N9234: CN5.1 R93.2
$4N9253: CN5.3 R89.2

## Notes on the sheets
sheet 3
- L
- R
- L
- R
